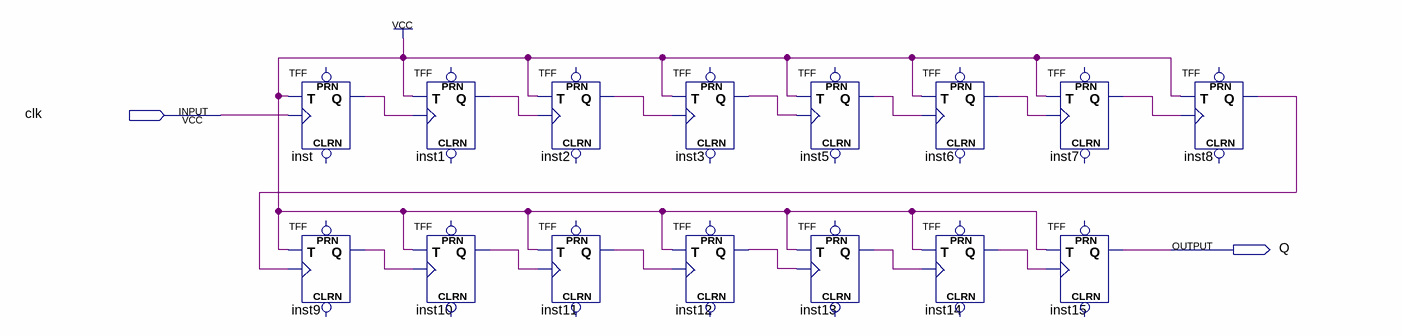
[diagram p0: schematic sheet]
// Quartus schematic Divisor.bdf as structural Verilog: 15 symbols, 2 pins
module Divisor (
  input  clk,
  output Q
);

  wire inst1_q, inst2_q, inst3_q, inst5_q, inst6_q, inst7_q, inst8_q, inst9_q, inst10_q, inst11_q, inst12_q,
       inst13_q, inst14_q, inst_q;

  TFF inst (.T(1'b1), .CLK(clk), .Q(inst_q));  // open: PRN, CLRN
  TFF inst9 (.T(1'b1), .CLK(inst8_q), .Q(inst9_q));  // open: PRN, CLRN
  TFF inst1 (.T(1'b1), .CLK(inst_q), .Q(inst1_q));  // open: PRN, CLRN
  TFF inst10 (.T(1'b1), .CLK(inst9_q), .Q(inst10_q));  // open: PRN, CLRN
  TFF inst2 (.T(1'b1), .CLK(inst1_q), .Q(inst2_q));  // open: PRN, CLRN
  TFF inst11 (.T(1'b1), .CLK(inst10_q), .Q(inst11_q));  // open: PRN, CLRN
  TFF inst3 (.T(1'b1), .CLK(inst2_q), .Q(inst3_q));  // open: PRN, CLRN
  TFF inst12 (.T(1'b1), .CLK(inst11_q), .Q(inst12_q));  // open: PRN, CLRN
  TFF inst5 (.T(1'b1), .CLK(inst3_q), .Q(inst5_q));  // open: PRN, CLRN
  TFF inst13 (.T(1'b1), .CLK(inst12_q), .Q(inst13_q));  // open: PRN, CLRN
  TFF inst6 (.T(1'b1), .CLK(inst5_q), .Q(inst6_q));  // open: PRN, CLRN
  TFF inst14 (.T(1'b1), .CLK(inst13_q), .Q(inst14_q));  // open: PRN, CLRN
  TFF inst7 (.T(1'b1), .CLK(inst6_q), .Q(inst7_q));  // open: PRN, CLRN
  TFF inst15 (.T(1'b1), .CLK(inst14_q), .Q(Q));  // open: PRN, CLRN
  TFF inst8 (.T(1'b1), .CLK(inst7_q), .Q(inst8_q));  // open: PRN, CLRN
endmodule
